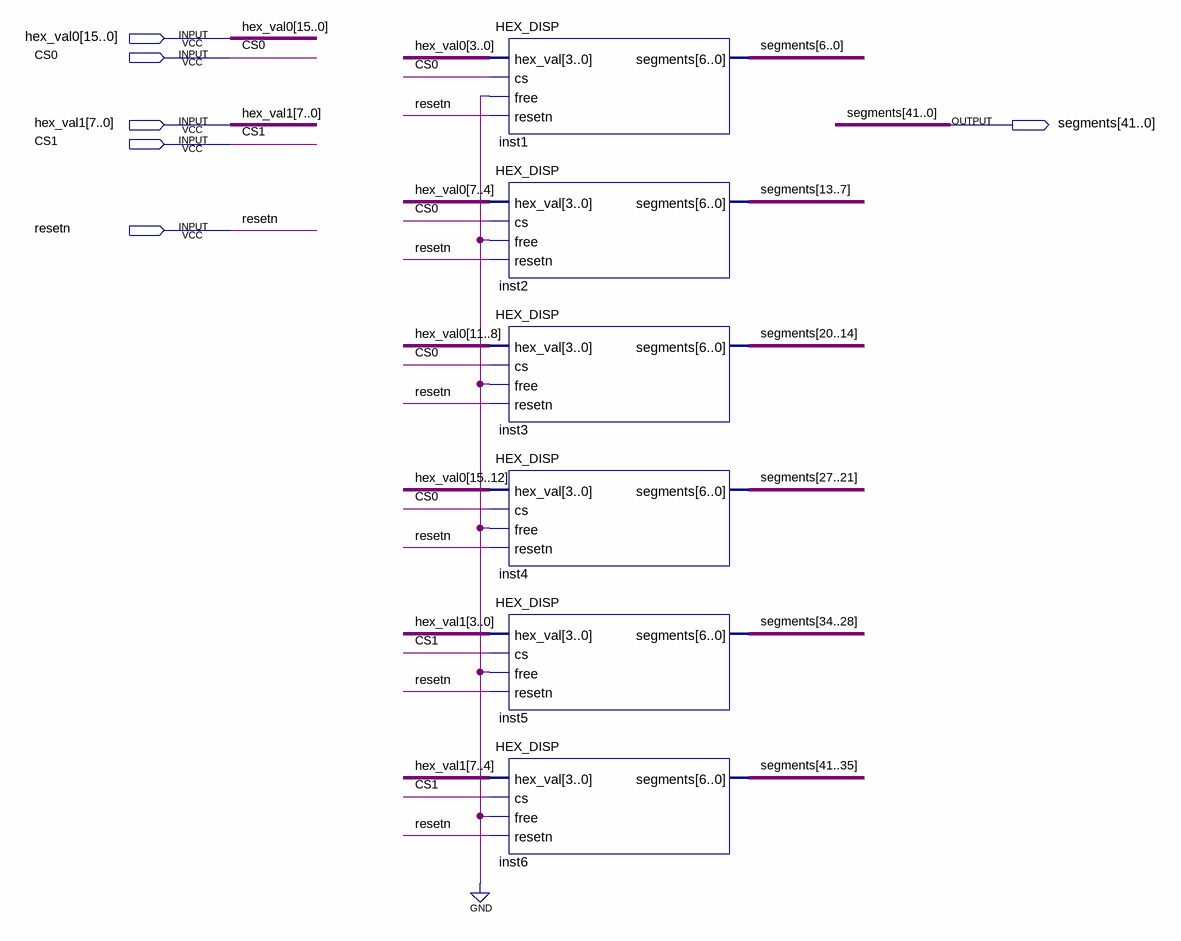
[diagram p0: schematic sheet]
// Quartus schematic HEX_DISP_6.bdf as structural Verilog: 6 symbols, 6 pins
module HEX_DISP_6 (
  input  [15:0] hex_val0,
  input  CS0,
  input  [7:0] hex_val1,
  input  CS1,
  input  resetn,
  output [41:0] segments
);

  HEX_DISP inst1 (.hex_val(hex_val0[3:0]), .cs(CS0), .free(1'b0), .resetn(resetn), .segments(segments[6:0]));
  HEX_DISP inst2 (.hex_val(hex_val0[7:4]), .cs(CS0), .free(1'b0), .resetn(resetn), .segments(segments[13:7]));
  HEX_DISP inst3 (.hex_val(hex_val0[11:8]), .cs(CS0), .free(1'b0), .resetn(resetn), .segments(segments[20:14]));
  HEX_DISP inst4 (.hex_val(hex_val0[15:12]), .cs(CS0), .free(1'b0), .resetn(resetn), .segments(segments[27:21]));
  HEX_DISP inst5 (.hex_val(hex_val1[3:0]), .cs(CS1), .free(1'b0), .resetn(resetn), .segments(segments[34:28]));
  HEX_DISP inst6 (.hex_val(hex_val1[7:4]), .cs(CS1), .free(1'b0), .resetn(resetn), .segments(segments[41:35]));
endmodule
